# Altium schematic sheet SignalProcessing.SchDoc
size A4
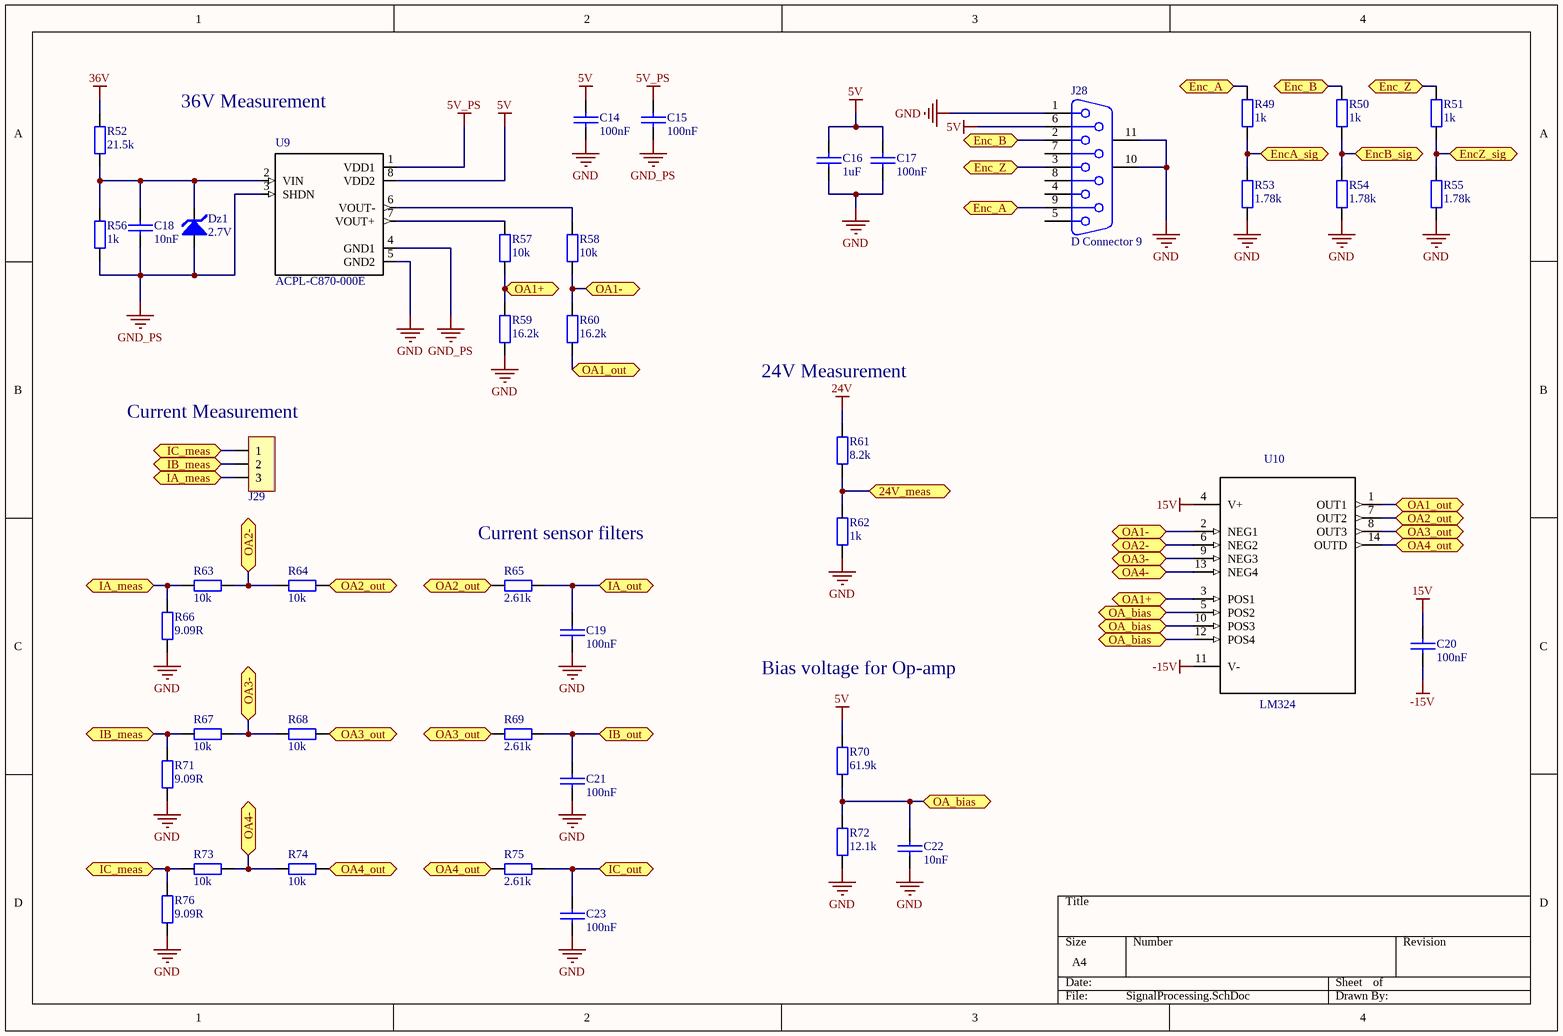
[diagram p0: SignalProcessing.SchDoc]

## Parts
C14  100nF  [1206]
C15  100nF  [1206]
C16  1uF  [1206]
C17  100nF  [1206]
C18  10nF  [1206]
C19  100nF  [1206]
C20  100nF  [1206]
C21  100nF  [1206]
C22  10nF  [1206]
C23  100nF  [1206]
Dz1  2.7V  [Diodo]
J28  D Connector 9  [DSUB1.385-2H9]
J29  Cleva 2 vias  [Con3_KK_256]  (value not drawn)
R49  1k  [1206]
R50  1k  [1206]
R51  1k  [1206]
R52  21.5k  [1206]
R53  1.78k  [1206]
R54  1.78k  [1206]
R55  1.78k  [1206]
R56  1k  [1206]
R57  10k  [1206]
R58  10k  [1206]
R59  16.2k  [1206]
R60  16.2k  [1206]
R61  8.2k  [1206]
R62  1k  [1206]
R63  10k  [1206]
R64  10k  [1206]
R65  2.61k  [1206]
R66  9.09R  [1206]
R67  10k  [1206]
R68  10k  [1206]
R69  2.61k  [1206]
R70  61.9k  [1206]
R71  9.09R  [1206]
R72  12.1k  [1206]
R73  10k  [1206]
R74  10k  [1206]
R75  2.61k  [1206]
R76  9.09R  [1206]
U9  ACPL-C870-000E  [SOIC127P1150X360-8N]
U10  LM324  [SOIC_14]

## Ports
24V_meas, Enc_A, Enc_B, Enc_Z, EncA_sig, EncB_sig, EncZ_sig, IA_meas, IA_out, IB_meas, IB_out, IC_meas, IC_out, OA1+, OA1-, OA1_out, OA2-, OA2_out, OA3-, OA3_out, OA4-, OA4_out, OA_bias

## Nets
5V: C14.1 C16.1 C17.1 J28.6 R70.2 U9.8(VDD2)
5V_PS: C15.1 U9.1(VDD1)
15V: C20.1 U10.4(V+)
24V: R61.1
36V: R52.1
-15V: C20.2 U10.11(V-)
GND: C14.2 C16.2 C17.2 C19.2 C21.2 C22.2 C23.2 J28.1 J28.10(MH1) J28.11(MH2) R53.1 R54.1 R55.1 R59.2 R62.2 R66.2 R71.2 R72.1 R76.2 U9.5(GND2)
GND_PS: C15.2 C18.2 Dz1.1(A) R56.2 U9.3(SHDN) U9.4(GND1)
24V_meas: R61.2 R62.1 ; port 24V_meas
Enc_A: J28.9 R49.2 ; port Enc_A
Enc_B: J28.2 R50.2 ; port Enc_B
Enc_Z: J28.3 R51.2 ; port Enc_Z
EncA_sig: R49.1 R53.2 ; port EncA_sig
EncB_sig: R50.1 R54.2 ; port EncB_sig
EncZ_sig: R51.1 R55.2 ; port EncZ_sig
IA_meas: J29.3 R63.1 R66.1 ; port IA_meas
IA_out: C19.1 R65.2 ; port IA_out
IB_meas: J29.2 R67.1 R71.1 ; port IB_meas
IB_out: C21.1 R69.2 ; port IB_out
IC_meas: J29.1 R73.1 R76.1 ; port IC_meas
IC_out: C23.1 R75.2 ; port IC_out
OA1+: R57.2 R59.1 U10.3(POS1) ; port OA1+
OA1-: R58.1 R60.1 U10.2(NEG1) ; port OA1-
OA1_out: R60.2 U10.1(OUT1) ; port OA1_out
OA2-: R63.2 R64.1 U10.6(NEG2) ; port OA2-
OA2_out: R64.2 R65.1 U10.7(OUT2) ; port OA2_out
OA3-: R67.2 R68.1 U10.9(NEG3) ; port OA3-
OA3_out: R68.2 R69.1 U10.8(OUT3) ; port OA3_out
OA4-: R73.2 R74.1 U10.13(NEG4) ; port OA4-
OA4_out: R74.2 R75.1 U10.14(OUTD) ; port OA4_out
OA_bias: C22.1 R70.1 R72.2 U10.5(POS2) U10.10(POS3) U10.12(POS4) ; port OA_bias
NetC18_1: C18.1 Dz1.2(K) R52.2 R56.1 U9.2(VIN)
NetR57_1: R57.1 U9.7(VOUT+)
NetR58_2: R58.2 U9.6(VOUT-)

Not connected (* = marked no-connect by the designer): J28 4 5 7 8

## Notes on the sheet
- 36V Measurement
- 24V Measurement
- (near J29) Current Measurement
- (near R65) Current sensor filters
- Bias voltage for Op-amp

## Library data of the parts
C14-C23 = Condensador
Dz1 = Zener
J28 = D Connector 9: Receptacle Assembly, 9 Position, Right Angle; PackageDocument: O; Positions: 9; Published: 15-Jun-2001; LatestRevisionDate: 17-Jul-2002; LatestRevisionNote: Re-released for DXP Platform.; DatasheetDocument: 1-Sep-1999; PackageReference: 788750; Publisher: Altium Limited; Orientation: Right Angle; Gender: Receptacle
J29 = Con_3
R49-R76 = Resistencia: Potencia: 1/4W
U9 = ACPL-C870-000E: Isolation Amplifier [Broadcom] ACPL-C870-000E Isolation Amplifier; MF: Broadcom Limited; Package: SO-8 Broadcom; Digi-Key_Part_Number: 516-2578-5-ND; MP: ACPL-C870-000E; Digi-Key_Purchase_URL: https://www.digikey.dk/product-detail/en/broadcom-limited/ACPL-C870-000E/516-2578-5-ND/3523705?utm_source=snapeda&utm_medium=aggregator&utm_campaign=symbol; SnapEDA_Link: https://www.snapeda.com/parts/ACPL-C870-000E/Broadcom%20Limited/view-part/?ref=snap; Value: *
U10 = LMC6484IM_1: 14 pin CMOS Quad Rail to Rail Input and Output Operational Amplifier 55 per tube; MF: Texas Instruments; Price: None; MP: LMC6484IM; SnapEDA_Link: https://www.snapeda.com/parts/LMC6484IM/Texas%20Instruments/view-part/?ref=snap; Availability: Unavailable; Package: SOIC-14 Texas Instruments; Value: *